# EAGLE design 611_jetbot_127 (EAGLE 9.6.0)
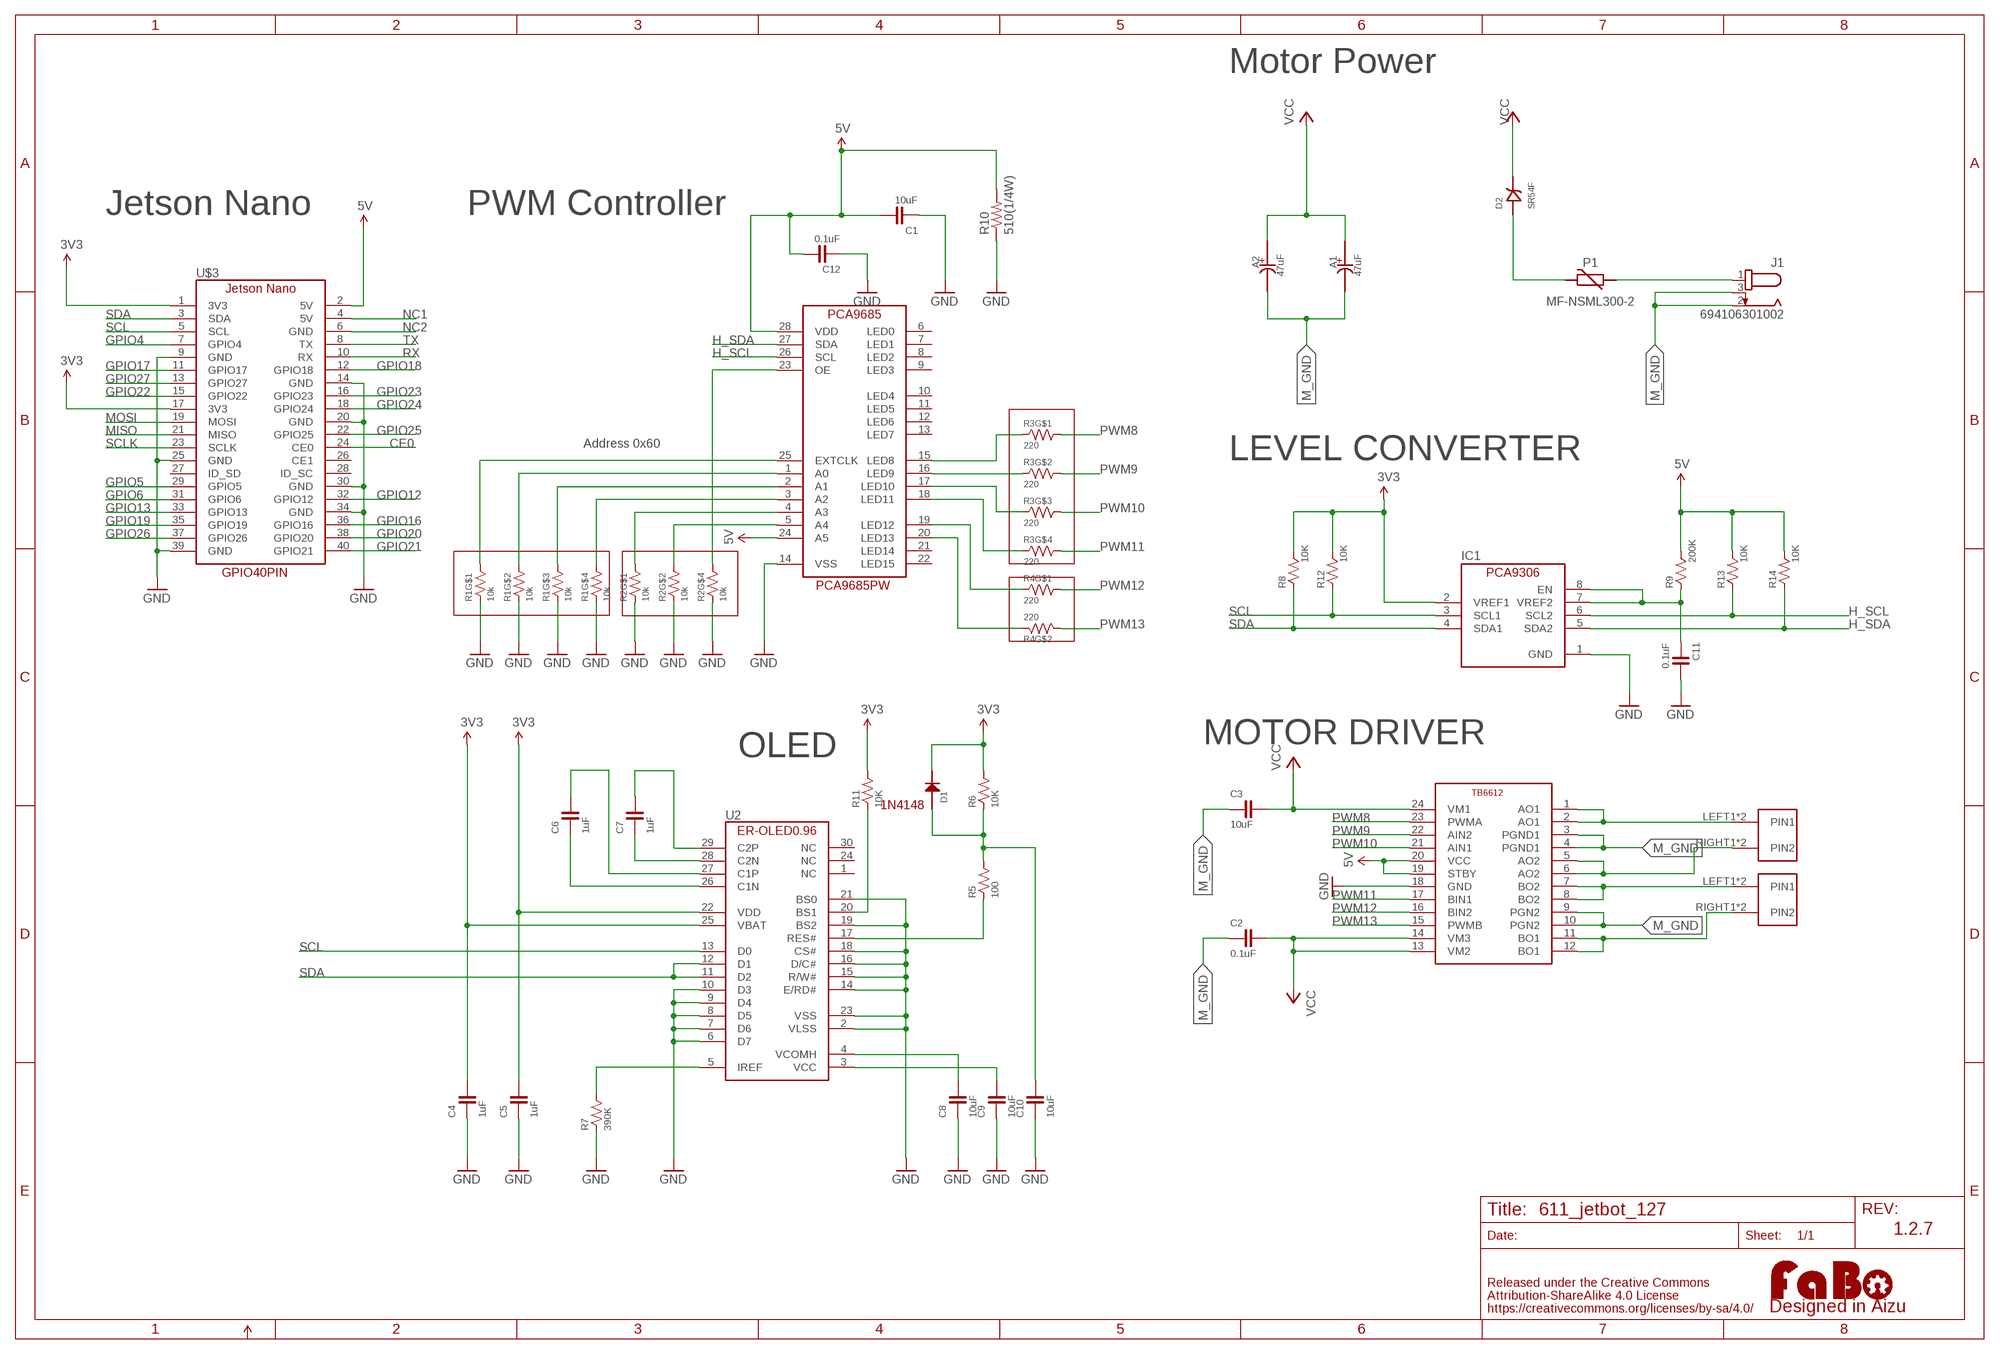
[diagram p0: schematic, sheet 1]

## Parts
A1  47uF  CAPACITOR-ALUMIN_D60  [D60]
A2  47uF  CAPACITOR-ALUMIN_D60  [D60]
C1  10uF  CAPACITOR-0603  [0603]
C2  0.1uF  CAPACITOR-0603  [0603]
C3  10uF  CAPACITOR-0603  [0603]
C4  1uF  CAPACITOR-0603-BOTTOM  [0603-BOTTOM]
C5  1uF  CAPACITOR-0603-BOTTOM  [0603-BOTTOM]
C6  1uF  CAPACITOR-0603-BOTTOM  [0603-BOTTOM]
C7  1uF  CAPACITOR-0603-BOTTOM  [0603-BOTTOM]
C8  10uF  CAPACITOR-0603-BOTTOM  [0603-BOTTOM]
C9  10uF  CAPACITOR-0603-BOTTOM  [0603-BOTTOM]
C10  10uF  CAPACITOR-0603-BOTTOM  [0603-BOTTOM]
C11  0.1uF  CAPACITOR-0603  [0603]
C12  0.1uF  CAPACITOR-0603  [0603]
D1  1N4148  [1N4148W]
D2  SR54F  [SMBF]
IC1  PCA9306_SSOP  [8PIN-SSOP]
IC4  PCA9685  [PCA9685]
J1  694106301002  [694106301002]
LOGO1  LOGO_FABO-M  [LOGO_FABO_M]
P1  MF-NSML300-2  POLYSWITCH1206  [1206]
R1  10k  RESISTOR_ARRAY  [EXBV8V]
R2  10k  RESISTOR_ARRAY  [EXBV8V]
R3  220  RESISTOR_ARRAY  [EXBV8V]
R4  220  RESISTOR_ARRAY  [EXBV8V]
R5  100  RESISTOR-0603-BOTTOM  [0603-BOTTOM]
R6  10K  RESISTOR-0603-BOTTOM  [0603-BOTTOM]
R7  390K  RESISTOR-0603-BOTTOM  [0603-BOTTOM]
R8  10K  RESISTOR-0603  [0603]
R9  200K  RESISTOR-0603  [0603]
R10  510(1/4W)  R-US_R0805  [R0805]
R11  10K  RESISTOR-0603-BOTTOM  [0603-BOTTOM]
R12  10K  RESISTOR-0603  [0603]
R13  10K  RESISTOR-0603  [0603]
R14  10K  RESISTOR-0603  [0603]
U2  ER-OLED0.96-1ER-CON30HT-1_REV2  [ER-CON30HT-1_REV2]
U$3  JETSON_NANO  [JETSON_NANO]
U$5  TB6612  [TB6612]
U$6  ML-1400-S1  [ML-1400-S1]
U$8  ML-1400-S1  [ML-1400-S1]

## Nets
3V3: C4.2 C5.2 D1.CATHODE IC1.2(VREF1) R6.2 R8.2 R11.2 R12.2 U2.22(VDD) U2.25(VBAT) U$3.1(3V3) U$3.17(3V3)
5V: C1.2 C12.2 IC4.24(A5) IC4.28(VDD) R9.2 R10.2 R13.2 R14.2 U$3.2(5V) U$5.19(STBY) U$5.20(VCC)
CE0: U$3.24(CE0)
GND: C1.1 C4.1 C5.1 C8.1 C9.1 C10.1 C11.2 C12.1 IC1.1(GND) IC4.14(VSS) R1.1 R1.2 R1.3 R1.4 R2.1 R2.2 R2.4 R7.1 R10.1 U2.2(VLSS) U2.6(D7) U2.7(D6) U2.8(D5) U2.9(D4) U2.10(D3) U2.14(E/RD#) U2.15(R/W#) U2.16(D/C#) U2.18(CS#) U2.19(BS2) U2.21(BS0) U2.23(VSS) U$3.9(GND) U$3.14(GND) U$3.20(GND) U$3.25(GND) U$3.30(GND) U$3.34(GND) U$3.39(GND) U$5.18(GND)
GPIO4: U$3.7(GPIO4)
GPIO5: U$3.29(GPIO5)
GPIO6: U$3.31(GPIO6)
GPIO12: U$3.32(GPIO12)
GPIO13: U$3.33(GPIO13)
GPIO16: U$3.36(GPIO16)
GPIO17: U$3.11(GPIO17)
GPIO18: U$3.12(GPIO18)
GPIO19: U$3.35(GPIO19)
GPIO20: U$3.38(GPIO20)
GPIO21: U$3.40(GPIO21)
GPIO22: U$3.15(GPIO22)
GPIO23: U$3.16(GPIO23)
GPIO24: U$3.18(GPIO24)
GPIO25: U$3.22(GPIO25)
GPIO26: U$3.37(GPIO26)
GPIO27: U$3.13(GPIO27)
H_SCL: IC1.6(SCL2) IC4.26(SCL) R13.1
H_SDA: IC1.5(SDA2) IC4.27(SDA) R14.1
M_GND: A1.MINUS(-) A2.MINUS(-) C2.1 C3.1 J1.2 J1.3 U$5.3(PGND1) U$5.4(PGND1) U$5.9(PGN2) U$5.10(PGN2)
MISO: U$3.21(MISO)
MOSI: U$3.19(MOSI)
N$7: IC4.23(OE) R2.5
N$8: IC4.25(EXTCLK) R1.8
N$9: IC4.1(A0) R1.7
N$10: IC4.2(A1) R1.6
N$11: IC4.3(A2) R1.5
N$12: IC4.4(A3) R2.8
N$13: IC4.5(A4) R2.7
N$14: C6.2 U2.27(C1P)
N$16: C6.1 U2.26(C1N)
N$17: U$5.1(AO1) U$5.2(AO1) U$6.LEFT1(PIN1) U$6.LEFT2(PIN1)
N$18: U$5.5(AO2) U$5.6(AO2) U$6.RIGHT1(PIN2) U$6.RIGHT2(PIN2)
N$19: C7.1 U2.28(C2N)
N$20: U$5.7(BO2) U$5.8(BO2) U$8.LEFT1(PIN1) U$8.LEFT2(PIN1)
N$21: C7.2 U2.29(C2P)
N$22: U$5.11(BO1) U$5.12(BO1) U$8.RIGHT1(PIN2) U$8.RIGHT2(PIN2)
N$23: R7.2 U2.5(IREF)
N$24: C8.2 U2.4(VCOMH)
N$25: C9.2 U2.3(VCC)
N$26: R5.1 U2.17(RES#)
N$27: C10.2 D1.ANODE R5.2 R6.1
N$28: R11.1 U2.20(BS1)
N$29: C11.1 IC1.7(VREF2) IC1.8(EN) R9.1
NC1: U$3.4(5V)
NC2: U$3.6(GND)
P8: IC4.15(LED8) R3.1
P9: IC4.16(LED9) R3.2
P10: IC4.17(LED10) R3.3
P11: IC4.18(LED11) R3.4
P12: IC4.19(LED12) R4.1
P13: IC4.20(LED13) R4.2
PTCP1: J1.1 P1.1
PTCP2: D2.ANODE P1.2
PWM8: R3.8 U$5.23(PWMA)
PWM9: R3.7 U$5.22(AIN2)
PWM10: R3.6 U$5.21(AIN1)
PWM11: R3.5 U$5.17(BIN1)
PWM12: R4.8 U$5.16(BIN2)
PWM13: R4.7 U$5.15(PWMB)
RX: U$3.10(RX)
SCL: IC1.3(SCL1) R12.1 U2.13(D0) U$3.5(SCL)
SCLK: U$3.23(SCLK)
SDA: IC1.4(SDA1) R8.1 U2.11(D2) U2.12(D1) U$3.3(SDA)
TX: U$3.8(TX)
VCC: A1.PLUS(+) A2.PLUS(+) C2.2 C3.2 D2.CATHODE U$5.13(VM2) U$5.14(VM3) U$5.24(VM1)
Unconnected: IC4.6(LED0) IC4.7(LED1) IC4.8(LED2) IC4.9(LED3) IC4.10(LED4) IC4.11(LED5) IC4.12(LED6) IC4.13(LED7) IC4.21(LED14) IC4.22(LED15) R2.3 R2.6 R4.3 R4.4 R4.5 R4.6 U2.1(NC) U2.24(NC) U2.30(NC) U$3.26(CE1) U$3.27(ID_SD) U$3.28(ID_SC)

## Notes on the sheet
- Motor Power
- Jetson Nano | PWM Controller
- Address 0x60
- LEVEL CONVERTER
- GPIO40PIN
- PCA9685PW
- MOTOR DRIVER
- OLED
- 1N4148
- 1.2.7

## Library data of the parts
A1 A2 = FaBo-Capacitor:CAPACITOR-ALUMIN
C1-C12 = FaBo-Capacitor:CAPACITOR: CAPACITOR
D1 = FaBo-Diode:1N4148
D2 = FaBo-Diode:SR54F: SURFACE MOUNT SCHOTTKY BARRIER RECTIFIER 40V Volts 5 Amperes SMBF molded plastic Forwaord Voltage 0.55V DC Reverse Current 0.1mA
IC1 = FaBo-LevelTranslator:PCA9306
IC4 = FaBo-Motor:PCA9685
J1 = DC Power Jacks:694106301002: CONN PWR JACK 2.1X5.5MM SOLDER Manufacturer's datasheet <https://katalog.we-online.de/em/datasheet/6941xx301002.pdf>; CREATED_BY: PCBLayout.com; DIGIKEY_PART_NUMBER: 732-5930-ND; MANUFACTURER: Wurth Electronics Inc.; MPN: 694106301002
LOGO1 = component:LOGO_FABO
P1 = FaBo-Supply:POLYSWITCH
R1-R4 = component:RESISTOR_ARRAY
R5-R9 R11-R14 = FaBo-Resistors:RESISTOR: RESISTOR
R10 = rcl:R-US_: RESISTOR, American symbol; SPICEPREFIX: R
U2 = FaBo-Display:ER-OLED0.96-1: ER-CON30HT-1 Rev2 wide distance 0.23mm
U$3 = FaBo-Boards:JETSON_NANO
U$5 = FaBo-Motor:TB6612
U$6 U$8 = FaBo-Terminal:ML-1400-S1

## Board
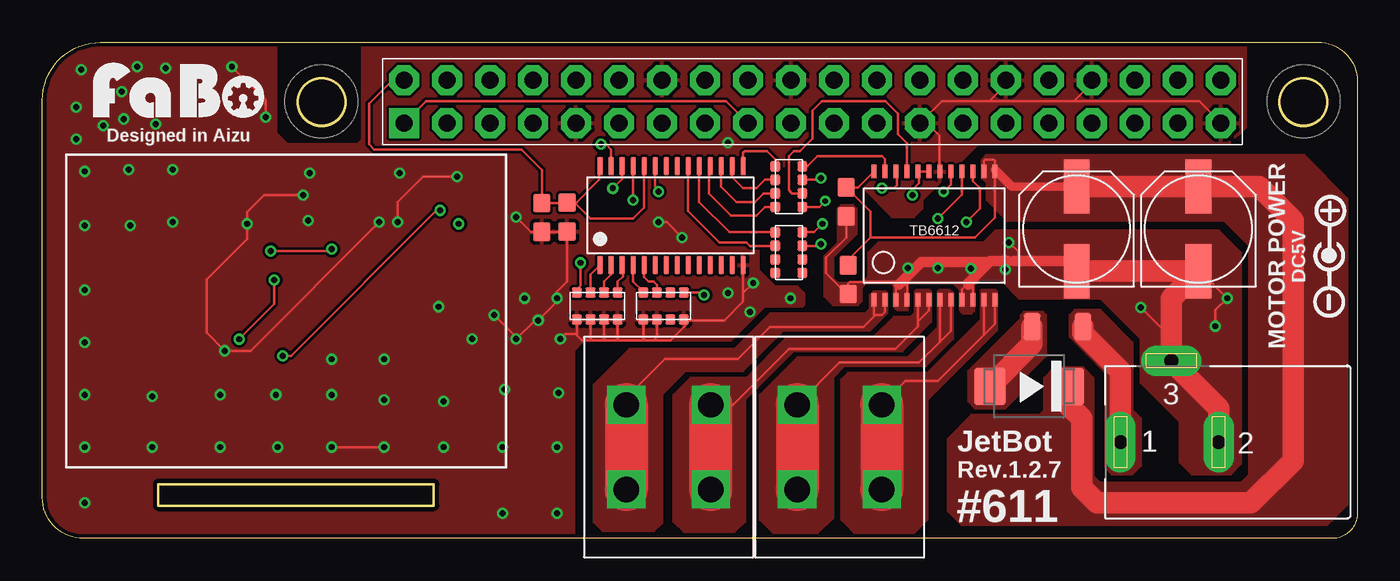
[diagram p1: board, top side]
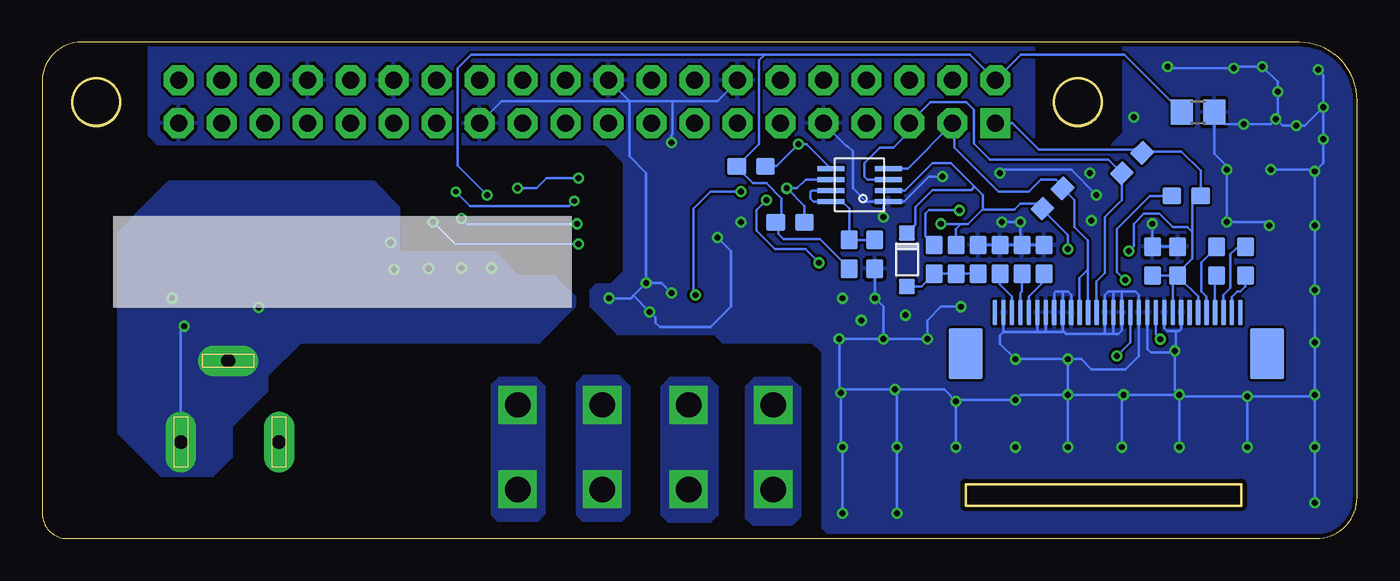
[diagram p2: board, bottom side, seen from below]

Size 69.05 x 25.26 mm. Coordinates in mm from the lower left corner, seen from the top.
Outline: 0,0 16.28,0 16.28,1.27 0,1.27 0,0
Outline: circle at 9.65,23.86 radius 1.4
Outline: circle at 67.65,23.86 radius 1.4
Copper layers (1*16): Top 0.035mm / dielectric 1.6mm / Bottom 0.035mm
Design rules "PCBway": minimum track width 6mil, minimum drill 12mil, track to track 6mil, track to pad 6mil, pad to pad 6mil, via to via 6mil, smd to smd 6mil, copper to edge 10mil, drill to drill 10mil, minimum pad ring 10mil, minimum via ring 6mil, stop-mask expansion 2mil, vias tented up to drill 100mil, thermal gap 8mil
tKeepout: area 22.3,-3 to 25,10
bRestrict: 7 lines

### Footprints (pad centres in the part's own frame; a part is rotated, then mirrored left to right if it is on the bottom)
D60 = smd 3.2 x 1.524: MINUS -2.5,0; PLUS 2.5,0
0603 = smd 1.1 x 1: 1 -0.85,0; 2 0.85,0
0603-BOTTOM = smd 1.1 x 1 bottom: 1 -0.85,0; 2 0.85,0
1N4148W = smd 0.9 x 0.95: ANODE 0,0; CATHODE 3.15,0
SMBF = smd 1.85 x 2.2: ANODE 2.325,0; CATHODE -2.325,0
8PIN-SSOP = smd 0.3 x 1.6: 1 -0.975,-1.7; 2 -0.325,-1.7; 3 0.325,-1.7; 4 0.975,-1.7; 5 0.975,1.7; 6 0.325,1.7; 7 -0.325,1.7; 8 -0.975,1.7
PCA9685 = smd 0.3 x 1.1: 1 -4.15,-2.93; 2 -3.5,-2.93; 3 -2.85,-2.93; 4 -2.2,-2.93; 5 -1.55,-2.93; 6 -0.9,-2.93; 7 -0.25,-2.93; 8 0.4,-2.93; 9 1.05,-2.93; 10 1.7,-2.93; 11 2.35,-2.93; 12 3,-2.93; 13 3.65,-2.93; 14 4.3,-2.93; 15 4.3,2.92; 16 3.65,2.92; 17 3,2.92; 18 2.35,2.92; 19 1.7,2.92; 20 1.05,2.92; 21 0.4,2.92; 22 -0.25,2.92; 23 -0.9,2.92; 24 -1.55,2.92; 25 -2.2,2.92; 26 -2.85,2.92; 27 -3.5,2.92; 28 -4.15,2.92
694106301002 = drill 0.8 pad 1.8 long: 1 13.6,0; 2 7.8,0; 3 10.6,-4.8
1206 = smd 1 x 1.6: 1 -1.5,0; 2 1.5,0
EXBV8V = smd 0.6 x 0.6: 1 -1.2,-0.8; 2 -0.4,-0.8; 3 0.4,-0.8; 4 1.2,-0.8; 5 1.2,0.8; 6 0.4,0.8; 7 -0.4,0.8; 8 -1.2,0.8
R0805 = smd 1.3 x 1.5: 1 -0.95,0; 2 0.95,0
ER-CON30HT-1_REV2 = smd 0.27 x 1.5 bottom: 1 7,-0.23; 2 6.5,-0.23; 3 6,-0.23; 4 5.5,-0.23; 5 5,-0.23; 6 4.5,-0.23; 7 4,-0.23; 8 3.5,-0.23; 9 3,-0.23; 10 2.5,-0.23; 11 2,-0.23; 12 1.5,-0.23; 13 1,-0.23; 14 0.5,-0.23; 15 0,-0.23; 16 -0.5,-0.23; 17 -1,-0.23; 18 -1.5,-0.23; 19 -2,-0.23; 20 -2.5,-0.23; 21 -3,-0.23; 22 -3.5,-0.23; 23 -4,-0.23; 24 -4.5,-0.23; 25 -5,-0.23; 26 -5.5,-0.23; 27 -6,-0.23; 28 -6.5,-0.23; 29 -7,-0.23; 30 -7.5,-0.23 | smd 2 x 3 bottom: 31 -9.07,-2.67; 32 8.74,-2.67
JETSON_NANO = drill 1 pad 1.778 square: 1 -24.13,10.16 | drill 1 pad 1.778 octagon: 2 -24.13,12.7; 3 -21.59,10.16; 4 -21.59,12.7; 5 -19.05,10.16; 6 -19.05,12.7; 7 -16.51,10.16; 8 -16.51,12.7; 9 -13.97,10.16; 10 -13.97,12.7; 11 -11.43,10.16; 12 -11.43,12.7; 13 -8.89,10.16; 14 -8.89,12.7; 15 -6.35,10.16; 16 -6.35,12.7; 17 -3.81,10.16; 18 -3.81,12.7; 19 -1.27,10.16; 20 -1.27,12.7; 21 1.27,10.16; 22 1.27,12.7; 23 3.81,10.16; 24 3.81,12.7; 25 6.35,10.16; 26 6.35,12.7; 27 8.89,10.16; 28 8.89,12.7; 29 11.43,10.16; 30 11.43,12.7; 31 13.97,10.16; 32 13.97,12.7; 33 16.51,10.16; 34 16.51,12.7; 35 19.05,10.16; 36 19.05,12.7; 37 21.59,10.16; 38 21.59,12.7; 39 24.13,10.16; 40 24.13,12.7
TB6612 = smd 0.3 x 0.8: 1 -3.575,-3.8; 2 -2.925,-3.8; 3 -2.275,-3.8; 4 -1.625,-3.8; 5 -0.975,-3.8; 6 -0.325,-3.8; 7 0.325,-3.8; 8 0.975,-3.8; 9 1.625,-3.8; 10 2.275,-3.8; 11 2.925,-3.8; 12 3.575,-3.8; 13 3.575,3.8; 14 2.925,3.8; 15 2.275,3.8; 16 1.625,3.8; 17 0.975,3.8; 18 0.325,3.8; 19 -0.325,3.8; 20 -0.975,3.8; 21 -1.625,3.8; 22 -2.275,3.8; 23 -2.925,3.8; 24 -3.575,3.8
ML-1400-S1 = drill 1.5 square: LEFT1 -2.5,2.5; LEFT2 -2.5,-2.5; RIGHT1 2.5,2.5; RIGHT2 2.5,-2.5

### Placement (x,y rotation side)
A1  61.45,16.36 90 top
A2  54.25,16.36 90 top
C1  22.66,17.04 90 top
C2  40.75,13.36 90 top
C3  40.65,17.96 90 top
C4  3.75,14.46 270 top
C5  5.25,14.46 270 top
C6  1.45,14.46 270 top
C7  -0.25,14.46 270 top
C8  12.95,14.56 270 top
C9  14.25,14.56 270 top
C10  15.55,14.56 270 top
C11  21.65,14.86 270 bottom
C12  24.15,17.06 90 top
D1  19.75,12.96 90 bottom
D2  51.45,7.06 180 top
IC1  22.55,18.96 90 bottom
IC4  30.25,17.16 0 top
J1  70.45,3.76 180 top
LOGO1  1.21,22.56 0 top
P1  53.13,10.58 180 top
R1  25.94,11.8 0 top
R2  29.85,11.8 0 top
R3  37.25,18.86 270 top
R4  37.25,14.96 270 top
R5  18.15,14.56 270 top
R6  16.85,14.56 90 top
R7  11.65,14.56 270 top
R8  11.15,18.16 225 bottom
R9  23.15,14.86 270 bottom
R10  2.55,23.26 180 bottom
R11  3.25,18.31 180 top
R12  6.45,20.26 45 bottom
R13  26.65,16.76 180 bottom
R14  28.95,20.06 180 bottom
U2  7.55,11.66 0 top
U$3  38.65,12.46 0 top
U$5  45.85,15.96 0 top
U$6  30.15,3.46 0 top
U$8  40.25,3.46 0 top

### Tracks (layer width: path | path; a pad name or v marks a point on that pad's centre or on a via)
3V3  (via drill 0.35)
  Top 0.152: v6.65,15.06 10.15,15.06 v10.25,15.16 | U$3.17 33.55,23.91 15.81,23.91 U$3.1
  Bottom 0.152: 3.58,13.43 3.62,13.48 | C4.2 3.62,13.61 3.62,13.48 | 3.62,13.48 3.62,13.43 2.55,12.36 U2.25 | 6.65,15.01 v6.65,15.06 6.35,15.36 6.35,16.66 5.75,17.26 4.85,17.26 4.05,16.46 3.2,16.46 2.9,16.16 | R6.2 16.85,16.36 16.55,16.66 | 15.3,17.51 16.15,16.66 16.55,16.66 | 15.3,17.51 15.25,17.56 15.25,18.36 15.75,18.86 | v10.25,15.16 10.25,16.01 11.75,17.51 R8.2 12.05,17.86 13.05,17.86 13.4,17.51 15.3,17.51 | v17.75,16.66 16.55,16.66 | 19.65,16.21 D1.CATHODE 19.25,16.61 19.25,17.66 18.25,18.66 15.95,18.66 15.75,18.86 | R11.2 2.9,17.81 2.9,16.16 | C4.2 3.75,13.75 | 3.75,13.75 2.9,14.61 2.9,16.16 | C5.2 3.89,13.61 3.75,13.75 | U2.22 4.05,13.31 C4.2 | 20.88,18.66 IC1.2 19.88,18.64 18.25,20.26 17.15,20.26 15.75,18.86 | 2.4,18.81 R11.2 | R11.2 2.4,19.81 3.53,20.94 5.92,20.94 | U$3.1 13.52,22.62 11.96,21.06 6.05,21.06 5.92,20.94 | R12.2 5.92,20.94
5V  (via drill 0.35)
  Top 0.152: U$3.2 13.85,25.16 12.45,23.76 12.45,21.36 12.75,21.06 21.45,21.06 22.66,19.85 C1.2 24.12,17.89 | 24.12,17.89 C12.2 24.7,17.91 26.05,19.26 26.05,20.03 IC4.28 | IC4.24 28.7,17.61 28.05,16.96 25.55,16.96 24.62,17.89 24.12,17.89 | U$5.19 U$5.20 44.95,19.69 44.95,19.06 44.55,18.66 v44.55,18.36
  Bottom 0.152: 28.15,26.67 45.49,26.67 46.3,25.86 46.3,20.11 v44.55,18.36 | 28.15,26.67 16.03,26.67 U$3.2 13.02,26.66 6.9,26.66 R10.2 | R14.2 29.73,20.14 | 29.73,20.14 28.5,21.36 28.5,26.32 28.15,26.67 | 29.73,20.14 29.73,19.94 28.85,19.06 28.05,19.06 27.15,18.16 27.15,17.11 R13.2 27.35,16.61 27.35,16.06 27.05,15.76 24.9,15.76 R9.2 22.8,13.66
GND  (via drill 0.35)
  Top 0.152: 49.1,23.91 46.29,23.91 45.09,22.71 | 45.09,22.71 U$3.25 | v13.05,16.76 5.45,9.16 v3.92,9.16 2.85,10.23 2.85,13.36 5.25,15.76 v5.25,16.66 5.25,17.36 6.25,18.36 v8.55,18.36 | U$3.30 50.08,24.89 49.1,23.91 | U$3.39 61.49,23.91 54.1,23.91 | 49.1,23.91 54.1,23.91 | U$3.34 55.16,24.97 54.1,23.91 | v13.35,3.46 v10.25,3.46 | v21.15,17.06 22.02,16.19 C1.1 24.12,16.19 C12.1 24.15,13.26 23.55,12.66 v23.55,12.26 23.55,12.06 v22.45,10.96 22.25,10.96 v21.15,9.86 21.15,9.96 v19.85,11.26 | R2.4 31.05,10.96 31.15,10.96 | 28.41,11 28.55,10.86 28.55,10.9 R2.1 28.66,9.86 28.75,9.76 | 25.54,10.96 R1.2 25.54,9.85 25.45,9.76 | 26.24,10.96 26.24,10.9 R1.3 26.34,9.85 26.25,9.76 | 24.78,10.96 R1.1 24.75,10.16 | IC4.14 34.55,12.56 | 34.55,12.56 34.55,12.06 33.45,10.96 31.15,10.96 | 46.1,19.84 U$5.18 46.15,19.79 46.15,21.86 45.3,22.71 45.09,22.71 | 24.75,10.16 24.75,10.06 25.05,9.76 25.45,9.76 | 31.15,10.96 31.15,10.66 30.25,9.76 29.25,9.76 | 25.45,9.76 26.25,9.76 | 26.25,9.76 27.15,9.76 | 27.15,9.76 28.75,9.76 | 28.75,9.76 29.25,9.76 | R2.2 29.45,9.96 29.25,9.76 | R1.4 27.14,9.77 27.15,9.76 | v35.15,13.16 34.55,12.56 | v17.65,19.46 15.65,19.46 14.15,17.96 v14.15,16.76 | v6.35,22.96 6.35,23.96 v4.35,25.96 | v23.75,9.86 24.05,10.16 24.75,10.16 | v29.55,16.76 30.05,16.76 v30.95,15.86
  Bottom 0.152: 3.75,15.46 C4.1 C5.1 v5.25,16.66 | 36.13,23.91 33.6,23.91 | 33.6,23.91 30.95,23.91 29.76,25.1 | 36.15,23.91 36.13,23.91 | 36.13,23.91 U$3.20 | U$3.25 43.71,23.91 36.15,23.91 | 14.05,10.26 11.95,10.26 | 11.95,10.26 11.65,10.26 | 11.65,10.26 10.45,10.26 | 10.45,10.26 10.55,10.36 U2.9 10.55,12.56 10.65,12.66 | 3.85,10.34 4.38,10.34 4.55,10.51 U2.21 | 3.85,10.34 3.68,10.34 3.55,10.46 U2.23 | R7.1 C8.1 | C8.1 C9.1 C10.1 | C8.1 13.05,15.51 v13.05,16.76 v14.15,16.76 | 3.85,10.34 3.85,9.23 v3.92,9.16 3.92,9.06 | 14.05,10.26 14.25,10.06 14.25,9.56 v13.35,8.66 v10.25,8.66 | v8.55,18.36 10.05,19.86 14.05,19.86 v14.25,19.66 | v-4.35,19.76 -4.25,19.86 v-1.75,19.86 | v-4.35,19.76 v-4.35,16.56 v-4.35,12.76 v-4.35,9.66 v-4.35,6.56 | v-4.35,6.56 -4.25,6.46 v-0.35,6.46 | 3.92,9.06 3.92,6.83 v3.65,6.56 | v3.65,6.56 3.55,6.46 v-0.35,6.46 | v3.65,6.56 v6.95,6.56 | v6.95,6.56 v10.25,6.56 | v10.25,8.66 v10.25,6.56 | v-4.35,6.56 v-4.35,3.46 v-4.35,0.16 | v-0.35,6.46 v-0.35,3.46 | v3.65,6.56 v3.65,3.46 | v6.95,6.56 7.05,6.46 v7.05,3.46 | v10.25,6.56 v10.25,3.46 | v13.35,3.46 13.45,3.46 | U2.19 5.55,9.26 5.35,9.06 3.92,9.06 | v10.25,8.66 9.45,8.66 8.85,8.06 6.85,8.06 6.05,8.86 U2.18 6.05,12.46 6.25,12.66 7.05,12.66 | 10.45,10.26 10.35,10.16 8.15,10.16 | 7.55,10.16 7.25,10.16 7.05,10.36 U2.16 7.05,12.66 | 7.55,10.16 8.15,10.16 | 7.55,10.16 U2.15 7.55,12.66 | 8.15,10.16 8.05,10.26 U2.14 8.05,12.46 7.85,12.66 7.55,12.66 | 10.65,12.66 10.25,12.66 10.05,12.46 U2.10 | 10.65,12.66 10.95,12.66 11.05,12.56 U2.8 | U2.2 14.05,10.26 | U2.6 12.05,10.36 11.95,10.26 | U2.7 11.55,10.36 11.65,10.26 | 7.05,12.66 7.55,12.66 | 20.86,17.97 IC1.1 19.92,17.98 18.45,19.46 v17.65,19.46
  Bottom 0.152: 20.86,17.97 21.15,17.69 v21.15,17.06 | 21.7,13.96 C11.2 v21.65,12.26 21.15,11.76 21.15,9.96 | U$3.9 23.32,21.26 23.25,21.26 22.95,20.96 22.95,18.76 22.16,17.97 20.86,17.97 | v35.15,13.16 35.15,19.66 36.15,20.66 36.15,23.91 | v-4.85,23.56 -4.85,25.46 v-4.55,25.76 | v-4.85,23.56 v-4.85,21.66 -4.85,20.26 v-4.35,19.76 | v-2.05,22.86 -1.75,22.56 v-0.15,22.56 0.9,22.56 R10.1 1.6,20.81 0.65,19.86 v0.85,19.86 0.95,19.86 0.85,19.76 v0.85,16.76 -1.45,16.76 v-1.65,16.56 | v-2.05,22.86 -2.15,22.96 v-2.15,24.46 -2.15,25.06 v-1.25,25.96 0.35,25.96 v0.45,25.86 4.25,25.86 v4.35,25.96 | v-4.85,23.56 -3.75,22.46 v-3.25,22.46 -2.45,22.46 v-2.05,22.86 | v10.25,6.56 13.05,6.56 v13.35,6.26 16.75,6.26 v16.85,6.16 | v16.85,6.16 17.55,6.86 v20.45,6.86 20.55,6.86 | 20.55,6.86 23.45,6.86 23.5,6.81 | 23.5,6.81 v23.65,6.66 23.65,3.56 v23.55,3.46 v23.55,-0.44 | 20.55,6.86 20.35,6.66 v20.35,3.46 v20.35,-0.44 | v16.85,3.46 v16.85,6.16 | v16.55,11.76 17.75,11.76 18.55,10.96 v18.55,9.86 v21.15,9.86 21.15,9.96 | 21.15,9.96 21.25,9.86 v23.75,9.86 23.75,7.06 23.5,6.81 | 35.9,12.41 v34.95,11.46 34.6,11.11 34.6,10.81 34.35,10.56 31.35,10.56 30.15,11.76 30.15,15.06 v30.95,15.86 | v37.35,12.26 36.05,12.26 35.9,12.41 | v33.65,12.56 34.25,13.16 v35.15,13.16 | 35.9,12.41 v35.15,13.16 | v33.65,21.46 33.65,21.91 33.6,21.96 33.6,23.91
  other vias: 8.85,16.86 8.95,19.66
  pour Bottom: -8.15,25.46 -4.55,29.06 5.15,29.06 6.95,27.26 6.95,22.06 7.75,21.26 12.05,21.26 12.25,21.46 12.25,27.26 14.25,29.26 62.45,29.26 64.55,27.16 64.55,21.86 64.05,21.36 37.55,21.36 36.45,20.26 36.45,13.86 37.25,13.06 38.15,13.06 38.45,12.76 38.45,11.76 36.85,10.16 31.15,10.16 30.65,9.66 25.35,9.66 24.75,9.06 24.75,-1.34 23.15,-2.94 -4.65,-2.94 -8.15,0.56
  pour Top: -9.25,25.26 -5.15,29.36 5.55,29.36 6.95,27.96 6.95,22.06 7.65,21.36 11.75,21.36 12.05,21.66 12.05,27.56 14.35,29.86 62.65,29.86 64.25,28.26 64.25,22.36 63.25,21.36 48.45,21.36 45.15,18.06 45.15,17.56 44.65,17.06 43.35,17.06 41.65,18.76 41.65,19.66 41.25,20.06 35.85,20.06 35.45,19.66 35.45,13.96 36.45,12.96 37.75,12.96 38.15,12.56 38.15,11.86 38.05,11.76 35.85,11.76 33.85,9.76 25.15,9.76 24.55,9.16 24.55,-2.04 23.25,-3.34 -6.95,-3.34 -9.25,-1.04
H_SCL  (via drill 0.35)
  Top 0.152: v26.85,18.76 27.4,19.31 IC4.26
  Bottom 0.152: IC1.6 25.73,19.29 26.25,18.76 v26.85,18.76 25.8,17.71 R13.1
H_SDA  (via drill 0.35)
  Top 0.152: v26.15,21.36 26.45,21.36 26.75,21.06 IC4.27
  Bottom 0.152: 24.27,19.96 IC1.5 25.67,21.36 v26.15,21.36 27.45,20.06 R14.1
M_GND  (via drill 0.35)
  Top 0.152: 43.57,12.48 U$5.3 43.57,12.89 43.75,13.06 | 43.75,13.06 44.15,13.06 44.2,13.01 | 44.2,13.01 44.25,12.96 44.25,12.18 U$5.4 | 43.75,13.06 43.6,13.21 40.85,13.21 40.75,13.11 C2.1 40.7,12.51 39.45,13.76 39.45,14.66 40.65,15.86 C3.1 | U$5.10 48.12,12.98 48.05,13.06 47.85,13.06 47.75,13.06 47.48,12.79 U$5.9 | 44.25,13.06 44.2,13.01 | v44.3,14.06 44.23,13.98 44.23,13.54 | 48.17,13.84 48.17,13.48 | v50.25,15.56 50.8,15.01 50.8,14.46 | v58.05,11.71 59.85,9.91 59.85,9.51 | v62.45,10.61 62.45,11.56 v63.15,12.26 61.55,13.86 A1.MINUS | 50.55,14.46 v50.05,13.96 | v46.05,14.06 46.05,14.36 46.1,14.41 | v48,14.01 48,14.41
  Top 0.61: A2.MINUS 53.65,14.46 50.8,14.46 50.55,14.46 | 50.2,14.46 49.15,14.46 49.1,14.41 | 49.1,14.41 48.17,13.48 47.85,13.16 47.85,13.06 | 49.1,14.41 48,14.41 46.1,14.41 45.1,14.41 44.23,13.54 43.75,13.06
  Top 1.27: J1.2 62.65,5.76 J1.3 59.85,9.51 59.85,12.26 A1.MINUS A2.MINUS
  Bottom 0.152: J1.2 62.65,10.41 v62.45,10.61
  pour Top (no thermals): 55.65,12.26 58.05,9.86 58.05,7.26 60.35,4.96 60.35,2.56 61.05,1.86 63.35,1.86 63.95,2.46 63.95,14.96 62.65,16.26 49.45,16.26 48.75,15.56 42.55,15.56 41.95,14.96 41.95,13.56 41.55,13.16 40.15,13.16 39.85,13.46 39.85,14.66 41.25,16.06 41.25,17.56 41.05,17.76 40.35,17.76 40.15,17.56 40.15,15.56 39.35,14.76 39.35,12.36 39.85,11.86 41.35,11.86 41.55,12.06 41.55,12.86 41.85,13.16 43.25,13.16 43.45,12.96 43.45,11.76 43.65,11.56 44.25,11.56 44.25,13.16 46.95,13.16 47.35,12.76 47.35,11.56 47.55,11.36 48.05,11.36 48.2,11.51 48.2,13.01 48.55,13.36 49.75,13.36 50.85,12.26
  pour Bottom (no thermals): 59.65,2.86 60.75,1.76 63.85,1.76 66.35,4.26 66.35,9.16 66.35,16.16 63.35,19.16 51.25,19.16 51.15,19.06 49.75,17.66 49.75,15.16 49.55,14.96 44.05,14.96 42.65,13.56 40.55,13.56 39.35,12.36 39.35,11.76 41.45,9.66 55.55,9.66 57.55,7.66 57.55,6.76 59.65,4.66
N$7  (via drill 0.35)
  Top 0.152: 31.05,12.66 R2.5 32.11,12.6 v32.25,12.46 | v29.55,18.56 29.55,18.66 29.35,18.86 IC4.23
  Bottom 0.152: v32.25,12.46 32.35,12.56 32.35,17.56 31.35,18.56 v29.55,18.56
N$8  (via drill 0.35)
  Top 0.152: R1.8 24.63,12.71 24.95,13.02 v24.95,14.36 | IC4.25 v28.05,18.06
  Bottom 0.152: v28.05,18.06 28.65,17.46 28.65,16.26 27.55,15.16 25.75,15.16 v24.95,14.36
N$9
  Top 0.152: 25.54,12.77 R1.7 | R1.7 25.54,12.7 | R1.7 25.54,13.67 IC4.1
N$10
  Top 0.152: R1.6 26.34,13.25 26.75,13.66 IC4.2
N$11
  Top 0.152: R1.5 27.14,13.25 27.45,13.56 27.45,14.18 IC4.3
N$12
  Top 0.152: 28.75,12.7 R2.8 28.66,12.66 28.05,13.26 IC4.4
N$13
  Top 0.152: IC4.5 28.7,13.51 28.95,13.26 29.25,13.26 29.45,13.05 R2.7
N$14
  Bottom 0.152: C6.2 1.55,13.51 U2.27
N$16
  Bottom 0.152: C6.1 1.45,15.26 2.35,14.36 2.35,12.66 2.05,12.36 U2.26
N$17
  Top 0.152: U$5.1 42.27,11.26 42.38,11.26 | 42.38,11.26 41.67,10.56 36.15,10.56 34.25,8.66 29.95,8.66 26.75,5.46 27.15,5.46 U$6.LEFT1 | U$5.2 42.92,11.43 42.75,11.26 42.38,11.26
  Top 2.54: U$6.LEFT1 U$6.LEFT2
  pour Bottom (no thermals): 26.05,-0.64 26.05,6.96 26.65,7.56 28.75,7.56 29.25,7.06 29.25,-0.74 28.85,-1.14 26.55,-1.14
  pour Top (no thermals): 25.75,-0.99 25.75,7.16 27.85,9.26 34.05,9.26 36.15,11.36 41.75,11.36 42.05,11.66 42.05,12.46 42.25,12.66 42.95,12.66 43.05,12.56 43.05,11.36 42.05,10.36 36.95,10.36 34.55,7.96 31.15,7.96 29.75,6.56 29.75,-1.04 29.3,-1.49 26.25,-1.49
N$18
  Top 0.152: U$6.RIGHT1 33.95,5.96 37.25,9.26 43.55,9.26 44.88,10.59 44.88,10.89 | 44.88,10.89 U$5.5 | U$5.6 45.52,11.54 44.88,10.89
  Top 2.54: U$6.RIGHT2 U$6.RIGHT1
  pour Bottom (no thermals): 30.95,7.06 31.45,7.56 33.75,7.56 34.25,7.06 34.25,-0.54 33.85,-0.94 31.35,-0.94 30.95,-0.54
  pour Top (no thermals): 30.45,-0.94 31.05,-1.54 34.05,-1.54 34.65,-0.94 34.65,6.26 37.55,9.16 43.95,9.16 45.65,10.86 45.65,12.66 45.55,12.76 44.8,12.76 44.7,12.66 44.7,11.41 44.45,11.16 43.45,11.16 42.25,9.96 37.15,9.96 34.75,7.56 31.45,7.56 30.45,6.56
N$19
  Bottom 0.152: C7.1 -0.25,15.21 0.3,15.21 0.65,14.86 0.65,12.86 1.05,12.46 U2.28
N$20
  Top 0.152: U$8.LEFT1 40.25,8.46 44.95,8.46 46.17,9.68 | 46.17,9.68 U$5.7 | U$5.8 46.82,10.34 46.17,9.68
  Top 2.54: U$8.LEFT1 U$8.LEFT2
  pour Bottom (no thermals): 36.15,-0.44 36.15,7.06 36.75,7.66 38.85,7.66 39.25,7.26 39.25,-0.54 38.9,-0.89 36.6,-0.89
  pour Top (no thermals): 39.85,7.56 39.85,-0.74 38.95,-1.64 36.35,-1.64 35.55,-0.84 35.55,6.56 37.75,8.76 44.25,8.76 46.05,10.56 46.05,12.66 46.15,12.76 46.75,12.76 46.95,12.56 46.95,9.86 45.35,8.26 40.55,8.26
N$21
  Bottom 0.152: C7.2 -0.25,12.95 0.04,12.66 0.22,12.66 0.55,12.33 U2.29
N$22
  Top 0.152: U$8.RIGHT1 44.15,7.36 46.05,7.36 48.77,10.09 | 48.77,10.09 U$5.11 | U$5.12 49.42,10.73 48.77,10.09
  Top 2.54: U$8.RIGHT1 U$8.RIGHT2
  pour Bottom (no thermals): 41.15,-0.49 41.15,7.06 41.65,7.56 43.85,7.56 44.25,7.16 44.25,-0.54 43.9,-0.89 41.55,-0.89
  pour Top (no thermals): 40.35,7.46 40.35,-0.84 41.35,-1.84 44.45,-1.84 45.45,-0.84 45.45,6.26 49.55,10.36 49.55,12.66 49.45,12.76 48.65,12.76 48.6,12.71 48.6,11.01 45.45,7.86 40.75,7.86
N$23
  Bottom 0.152: R7.2 11.65,13.26 12.55,12.36 U2.5
N$24
  Bottom 0.152: C8.2 12.95,12.66 13.05,12.56 U2.4
N$25
  Bottom 0.152: C9.2 14.25,13.06 13.55,12.36 U2.3
N$26  (via drill 0.35)
  Top 0.152: v7.35,8.86 7.85,8.86 16.45,17.46 v16.65,17.46
  Bottom 0.152: R5.1 18.65,15.91 18.65,17.26 18.45,17.46 v16.65,17.46 | v7.35,8.86 6.55,9.66 U2.17
N$27
  Bottom 0.152: 15.55,13.56 C10.2 R6.1 R5.2 18.9,12.96 D1.ANODE
N$28  (via drill 0.35)
  Top 0.152: v4.78,9.84 6.86,11.92 v6.86,13.34
  Bottom 0.152: R11.1 5.39,18.31 7.34,16.36 7.34,13.82 v6.86,13.34 | v4.78,9.84 5.05,10.11 U2.20
N$29
  Bottom 0.152: IC1.7 25.38,18.64 25.45,18.56 25.45,18.16 25.27,17.98 IC1.8 23.58,17.98 23.15,17.56 R9.1 C11.1
P8
  Top 0.152: 36.43,20.08 R3.1 36.45,20.46 35.95,20.96 34.65,20.96 34.55,20.86 IC4.15
P9
  Top 0.152: R3.2 35.85,19.26 35.35,18.76 34.55,18.76 33.9,19.41 IC4.16
P10
  Top 0.152: R3.3 35.75,18.46 35.25,17.96 34.15,17.96 33.25,18.86 IC4.17
P11
  Top 0.152: R3.4 35.85,17.66 35.35,17.16 33.85,17.16 32.55,18.46 32.55,20.03 IC4.18
P12
  Top 0.152: R4.1 33.75,16.16 31.95,17.96 IC4.19
P13
  Top 0.152: R4.2 34.95,15.36 34.75,15.56 33.15,15.56 31.3,17.41 IC4.20
PTCP1
  Top 0.406: 54.73,10.68 P1.1
  Top 1.27: J1.1 56.85,7.95 54.63,10.18 P1.1
  pour Top (no thermals): 55.95,2.76 55.95,7.86 54.85,8.96 53.85,9.96 53.85,11.26 54.15,11.56 54.95,11.56 55.65,11.56 57.55,9.66 57.55,5.66 57.75,5.46 58.05,5.16 58.05,2.36 57.55,1.86 56.35,1.86 55.95,2.26
PTCP2
  Top 1.27: D2.ANODE 51.63,9.56 P1.2
  pour Top (no thermals): 49.85,5.76 48.25,5.76 47.85,6.16 47.85,7.96 48.15,8.26 50.95,11.06 50.95,11.26 51.15,11.46 51.55,11.46 52.25,11.46 52.45,11.26 52.45,8.86 50.85,7.26 50.85,6.56 50.05,5.76
PWM8
  Top 0.152: R3.8 38.35,20.06 38.95,20.66 42.75,20.66 42.92,20.48 U$5.23
PWM9  (via drill 0.35)
  Top 0.152: 38.1,19.26 R3.7 39.05,19.26 v39.15,19.36 | v42.75,18.77 43.46,18.77 43.65,18.96 43.65,19.69 U$5.22
  Bottom 0.152: v39.15,19.36 41.05,19.36 41.64,18.77 v42.75,18.77
PWM10
  Top 0.152: 38.15,18.56 R3.6 37.45,18.46 37.25,18.66 37.25,20.66 37.55,20.96 37.9,20.96 38.65,21.71 38.65,23.36 39.2,23.91 42.95,23.91 43.7,23.16 43.7,21.96 44.23,21.44 U$5.21
PWM11  (via drill 0.3)
  Top 0.152: v46.4,18.56 46.82,18.98 U$5.17 | R3.5 39.05,17.66 v39.4,18.01
  Bottom 0.152: v39.4,18.01 39.7,17.71 45.55,17.71 v46.4,18.56
PWM12  (via drill 0.35)
  Top 0.152: R4.8 38.75,16.16 v39.25,16.66 | v46.05,16.96 47.48,18.39 U$5.16
  Bottom 0.152: v39.25,16.66 45.75,16.66 v46.05,16.96
PWM13  (via drill 0.35)
  Top 0.152: 38.1,15.31 R4.7 39.05,15.36 v39.15,15.46 | v47.75,16.76 48.55,17.56 48.55,18.76 48.12,19.19 U$5.15
  Bottom 0.152: v39.15,15.46 46.45,15.46 v47.75,16.76
SCL
  Bottom 0.152: U2.13 8.55,13.26 8.05,13.76 8.05,17.06 7.05,18.06 R12.1 7.85,20.46 14.85,20.46 15.8,21.41 15.8,23.41 16.25,23.86 18.36,23.86 U$3.5 19.6,22.11 20.55,21.16 21.35,21.16 22.25,20.26 22.25,19.46 22.08,19.29 IC1.3
SDA
  Bottom 0.152: 9.05,13.96 9.55,13.46 U2.11 | U2.12 9.05,13.96 | IC1.4 19.7,19.94 17.06,22.57 U$3.3 16.95,22.51 16.95,21.16 14.35,18.56 12.55,18.56 11.85,19.26 10.95,19.26 10.45,18.76 | 10.25,18.76 10.45,18.76 | 10.45,18.76 R8.1 9.85,18.06 9.85,16.46 9.05,15.66 9.05,13.96
VCC
  Top 0.152: U$5.14 48.77,20.39 48.85,20.46 49.35,20.46 49.42,20.39 49.42,19.86 U$5.13 49.42,17.04 48.25,15.86 42.1,15.86 42.07,15.84 | U$5.24 41.32,18.81 C3.2 42.07,17.39 42.07,15.84 | 42.07,15.84 40.75,14.51 C2.2
  Top 0.508: A2.PLUS 50.42,18.86 49.42,19.86
  Top 1.27: A2.PLUS A1.PLUS 65.05,18.86 67.05,16.86 67.05,2.66 64.55,0.16 55.45,0.16 54.55,1.06 54.55,5.16 53.77,5.93 D2.CATHODE
  pour Top (no thermals): 52.35,7.56 52.95,8.16 54.65,8.16 55.25,7.56 55.25,1.76 55.65,1.36 63.95,1.36 64.45,1.86 64.45,15.36 62.95,16.86 50.15,16.86 48.95,18.06 48.95,19.06 48.65,19.36 48.65,20.46 48.9,20.71 67.7,20.71 70.25,18.16 70.25,0.06 69.05,-1.14 47.45,-1.14 46.65,-0.34 46.65,3.96 48.05,5.36 52.05,5.36 52.35,5.66

### Text on the board
tPlace: Designed in Aizu | MOTOR POWER | DC5V | JetBot | Rev.1.2.7 | #611
Document: PCA9685PW | SR54F | 694106301002 | #611 JetBot Controller Board(Rev 1.2.7)